# Altium schematic sheet Control.SchDoc
size A4
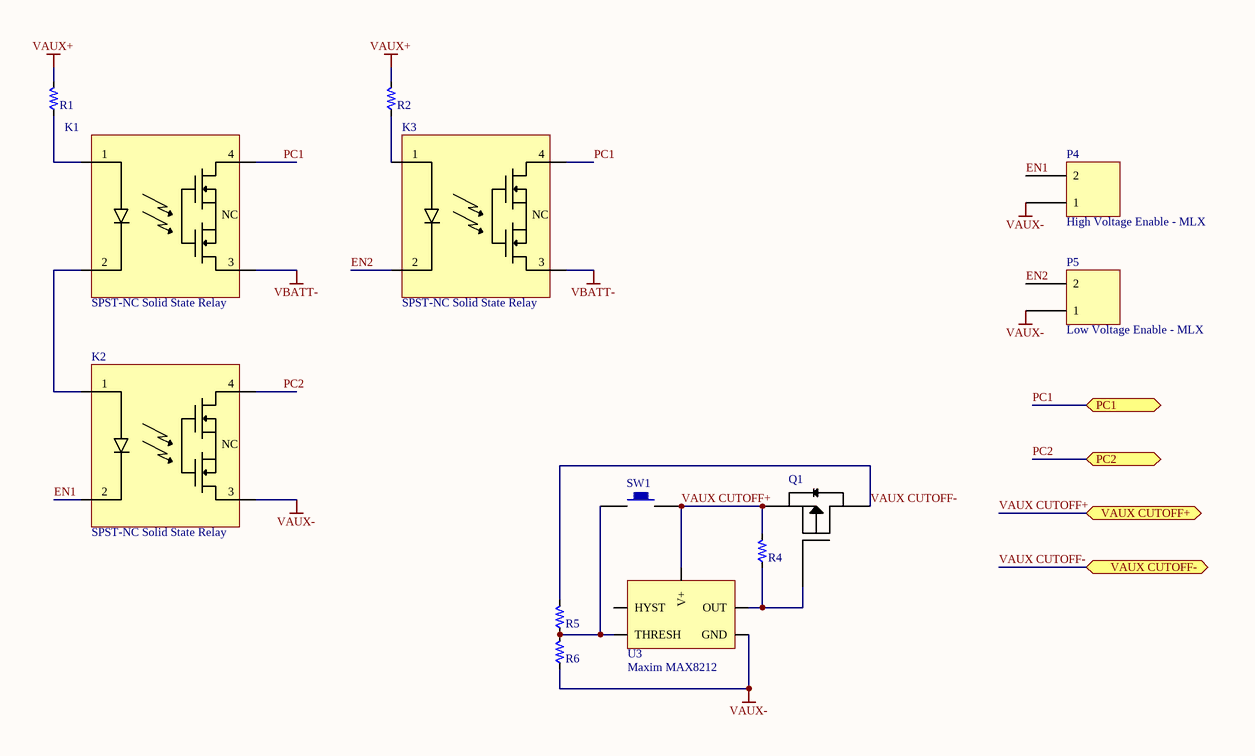
[diagram p0: Control.SchDoc]

## Parts
K1  SPST-NC Solid State Relay  [SPST-NC Solid State Relay - IXYS]
K2  SPST-NC Solid State Relay  [SPST-NC Solid State Relay - IXYS]
K3  SPST-NC Solid State Relay  [SPST-NC Solid State Relay - IXYS]
P4  High Voltage Enable - MLX  [PCB_MLX_MICROFIT_1X2]
P5  Low Voltage Enable - MLX  [PCB_MLX_MICROFIT_1X2]
Q1  AOS DPAK  MOSFET  (value not drawn)
R1  SCH_GENERIC_RESISTOR_0603  [PCB_GENERIC_SMD_0603]  (value not drawn)
R2  SCH_GENERIC_RESISTOR_0603  [PCB_GENERIC_SMD_0603]  (value not drawn)
R4  SCH_GENERIC_RESISTOR_0603  [PCB_GENERIC_SMD_0603]  (value not drawn)
R5  SCH_GENERIC_RESISTOR_0603  [PCB_GENERIC_SMD_0603]  (value not drawn)
R6  SCH_GENERIC_RESISTOR_0603  [PCB_GENERIC_SMD_0603]  (value not drawn)
SW1  Push Button Switch  [Push Button Switch]  (value not drawn)
U3  Maxim MAX8212

## Ports
PC1, PC2, VAUX CUTOFF+, VAUX CUTOFF-

## Nets
VAUX+: R1.2 R2.2
VAUX-: K2.3(Load) P4.1 P5.1 R6.1 U3.5(GND)
VBATT-: K1.3(Load) K3.3(Load)
EN1: K2.2(Control_-) P4.2
EN2: K3.2(Control_-) P5.2
PC1: K1.4(Load) K3.4(Load) ; port PC1
PC2: K2.4(Load) ; port PC2
VAUX CUTOFF+: Q1.3(S) R4.2 SW1.2 U3.8(V+) ; port VAUX CUTOFF+
VAUX CUTOFF-: Q1.4(D) R5.2 ; port VAUX CUTOFF-
NetK1_1: K1.1(Control_+) R1.1
NetK1_2: K1.2(Control_-) K2.1(Control_+)
NetK3_1: K3.1(Control_+) R2.1
NetQ1_1: Q1.1(G) R4.1 U3.4(OUT)
NetR5_1: R5.1 R6.2 SW1.1 U3.3(THRESH)

Not connected (* = marked no-connect by the designer): U3 2(HYST)

## Notes on the sheet
- (in symbol SPST-NC Solid State Relay) NC

## Library data of the parts
P4 P5 = SCH_MLX_1X2
R1 R2 R4-R6 = SCH_GENERIC_RESISTOR_0603: Generic SMD resistor 0603; Resistance: *
SW1 = PushButtonSwitch